# EasyEDA schematic Joakims fulle kort kretsskjema.json
TITLE: Watchdog module; REV: 2.5; Date: 2023-03-01; Sheet: 1/1; Drawn By: Joakim Vigemyr, Elab; Company: Department of Chemistry(UiO)
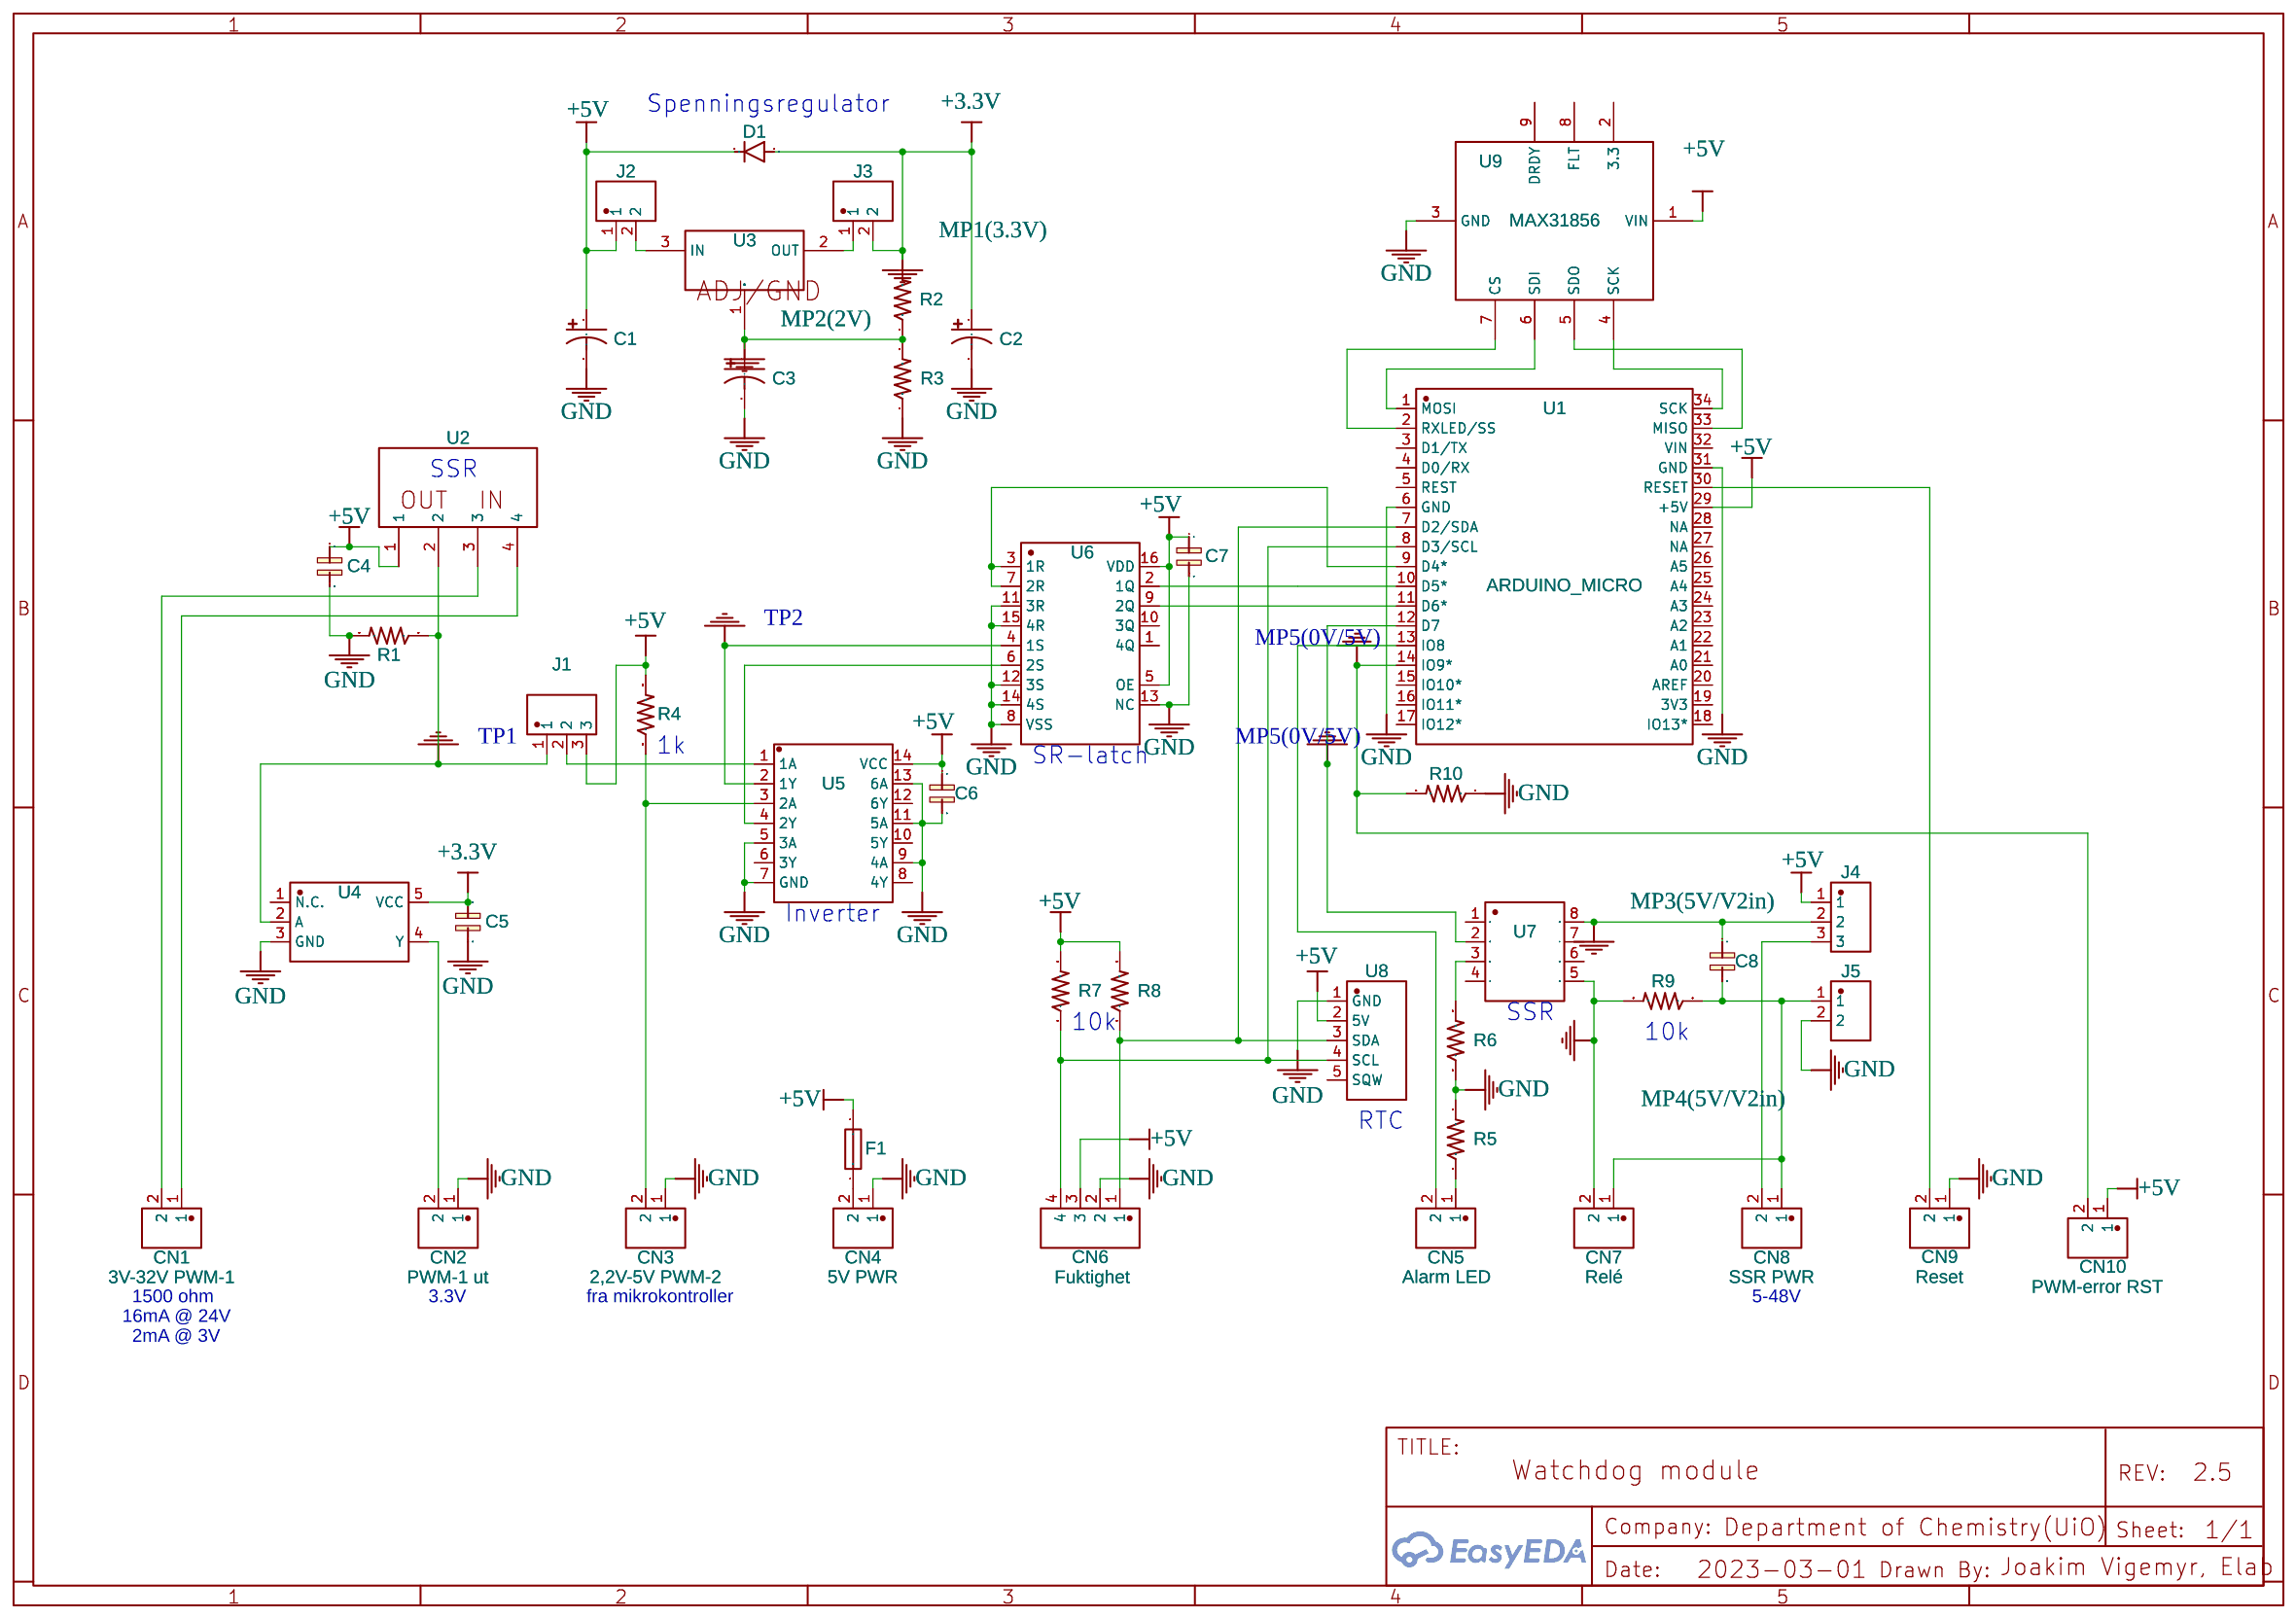
[diagram p0: schematic sheet]

## Parts
C1  10uF  [CPOL-RADIAL-100UF-25V]
C2  100uF  [CPOL-RADIAL-100UF-25V]
C3  47uF  [CPOL-RADIAL-100UF-25V]
C4  C_3216MP  [C3216MP]
C5  C_3216MP  [C3216MP]
C6  C_3216MP  [C3216MP]
C7  C_3216MP  [C3216MP]
C8  C_3216MP  [C3216MP]
CN1  3V-32V PWM-1  [CONN-TH_2P-P5.00_PHOENIX-CONTACT_1754436]
CN2  PWM-1 ut  [CONN-TH_2P-P5.00_PHOENIX-CONTACT_1754436]
CN3  2,2V-5V PWM-2  [CONN-TH_2P-P5.00_PHOENIX-CONTACT_1754436]
CN4  5V PWR  [CONN-TH_2P-P5.00_PHOENIX-CONTACT_1754436]
CN5  Alarm LED  [CONN-TH_2P-P5.00_PHOENIX-CONTACT_1754436]
CN6  Fuktighet  [CONN-TH_4P-P5.08_PHOENIXCONTACT_1888700]
CN7  Relé  [CONN-TH_2P-P5.00_PHOENIX-CONTACT_1754436]
CN8  SSR PWR  [CONN-TH_2P-P5.00_PHOENIX-CONTACT_1754436]
CN9  Reset  [CONN-TH_2P-P5.00_PHOENIX-CONTACT_1754436]
CN10  PWM-error RST  [CONN-TH_2P-P5.00_PHOENIX-CONTACT_1754436]
D1  1N4007  [DIODE-1N4001-KIT]
F1  0326025.MXP  [FUSE-SMD_LITTELFUSE-0326025]
J1  JUMPER3  [HDR-TH_3P-P2.54-V-M-A]
J2  JUMPER2  [HDR-TH_2P-P2.54-V-M-1]
J3  JUMPER2  [HDR-TH_2P-P2.54-V-M-1]
J4  JUMPER3  [HDR-TH_3P-P2.54-V-M-A]
J5  JUMPER2  [HDR-TH_2P-P2.54-V-M-1]
R1  200ohm  [AXIAL-0.1]
R2  200ohm  [AXIAL-0.1]
R3  330ohm  [AXIAL-0.1]
R4  1k  [AXIAL-0.1]
R5  180ohm  [AXIAL-0.1]
R6  330ohm  [AXIAL-0.1]
R7  10k  [AXIAL-0.1]
R8  10k  [AXIAL-0.1]
R9  10k  [AXIAL-0.1]
R10  10k  [AXIAL-0.1]
U1  ARDUINO_MICRO  [ARDUINO_MICRO]
U2  MPDCD3  [OPTO-TH_SENSATA_MPDCD3-B]
U3  TLV1117  [TO-252-3_L6.6-W6.1-P4.57-LS9.9-BR-CW]
U4  SN74LVC1G34  [SOT-23-5_L2.9-W1.6-P0.95-LS2.8-BL]
U5  SN74ACT04D  [SOIC-14_L8.7-W3.9-P1.27-LS6.0-BL]
U6  HEF4043BT,652  [SOIC-16_150MIL]
U7  XR2A-0811-N  [DIP-8_L10.2-W10.2-P2.54-LS7.6-BL]
U8  DS1307
U9  MAX31856  [ADAFRUIT MAX31856 BREAKOUT]

## Library data of the parts
C1-C3 = CAP_POLPTH1: Capacitor Polarized; Contributor: SparkFun
C4-C8 = -: Contributor: David Mora; Manufacturer Part: ?
CN1-CN5 CN7-CN10 = 1754436: Supplier: LCSC; Supplier Part: C3586499; Manufacturer: Phoenix Contact(菲尼克斯); link: https://atta.szlcsc.comnull; Contributor: lcsc
CN6 = 1888700: Supplier: LCSC; Supplier Part: C3816378; Manufacturer: Phoenix Contact(菲尼克斯); link: https://atta.szlcsc.comnull; Contributor: lcsc
D1 = DIODEKIT2: Diode; Contributor: SparkFun
F1 = 0326025.MXP: Supplier: LCSC; Supplier Part: C178977; Manufacturer: Littelfuse(美国力特); Contributor: lcsc; JLCPCB Part Class: Extended Part
J1 J4 = JUMPER3: Supplier: LCSC; Supplier Part: C2940050; Manufacturer: null; Manufacturer Part: Jumper3; Contributor: LCSC; JLCPCB Part Class: Extended Part
J2 J3 J5 = JUMPER2: Supplier: LCSC; Supplier Part: C2940092; Manufacturer: null; Manufacturer Part: Jumper2; Contributor: LCSC; JLCPCB Part Class: Extended Part
R1-R10 = RESISTORPTH-14W-VERT: Resistor; Contributor: SparkFun
U1 = ARDUINO_MICRO: Contributor: EasyEDA
U2 = MPDCD3-B: Supplier: LCSC; Supplier Part: C2616825; Manufacturer: Sensata; Contributor: LCSC
U3 = TLV1117-18CKVURG3: Supplier: LCSC; Supplier Part: C2870812; Manufacturer: TI(德州仪器); link: https://atta.szlcsc.comnull; Contributor: lcsc
U4 = SN74LVC1G17DBVT: Supplier: LCSC; Supplier Part: C2862344; Manufacturer: TI(德州仪器); link: https://atta.szlcsc.comnull; JLCPCB Part Class: Extended Part; Contributor: LCSC
U5 = SN74AC04DR: Supplier: LCSC; Supplier Part: C352940; Manufacturer: Texas Instruments; Contributor: LCSC; LCSC Assembly: Yes; SMT Type: Extend
U6 = -: Supplier: LCSC; Manufacturer: Nexperia; Manufacturer Part: HEF4543BT,653; Contributor: Jorgen_Hilsen; Supplier Part: C131489
U7 = XR2A-0811-N: Supplier: LCSC; Supplier Part: C231487; Manufacturer: OMRON(欧姆龙); Contributor: LCSC; JLCPCB Part Class: Extended Part
U8 = DS1307
U9 = -: link: https://learn.adafruit.com/adafruit-max31856-thermocouple-amplifier; Contributor: jove1

## Nets
+3.3V: C2.1(+) C5.1 D1.A J3.2 R2.P$2(2) U4.5(VCC)
+5V: C1.1(+) C4.1 C6.1 C7.1 CN6.3 CN10.1 D1.C F1.2 J1.3 J2.1 J4.1 R4.P$2(2) R7.P$2(2) R8.P$2(2) U1.29(+5V) U2.1 U5.14(VCC) U6.5(OE) U6.16(VDD) U8.2(5V) U9.1(VIN)
GND: C1.2(-) C2.2(-) C3.2(-) C4.2 C5.2 C6.2 C7.2 CN2.1 CN3.1 CN4.1 CN6.2 CN9.1 J5.2 R1.P$2(2) R3.P$1(1) R5.P$2(2) R6.P$1(1) R10.P$1(1) U1.6(GND) U1.31(GND) U4.3(GND) U5.5(3A) U5.7(GND) U5.9(4A) U5.11(5A) U5.13(6A) U6.8(VSS) U6.11(3R) U6.12(3S) U6.13(NC) U6.14(4S) U6.15(4R) U8.1(GND) U9.3(GND)
MP3(5V/V2in): C8.1 J4.2 U7.8
MP4(5V/V2in): CN7.2 R9.P$2(2) U7.5
MP5(0V/5V): CN10.2 R10.P$2(2) U1.12(D7) U1.14(IO9*) U7.2
MP2(2V): C3.1(+) R2.P$1(1) R3.P$2(2) U3.1(ADJ/GND)
TP1: J1.1 R1.P$1(1) U2.2 U4.2(A)
TP2: U5.2(1Y) U6.4(1S)
Net-(C8-2): C8.2 CN7.1 CN8.1 J5.1 R9.P$1(1)
Net-(CN1-1): CN1.1 U2.4
Net-(CN1-2): CN1.2 U2.3
Net-(CN2-2): CN2.2 U4.4(Y)
Net-(CN3-2): CN3.2 R4.P$1(1) U5.3(2A)
Net-(CN4-2): CN4.2 F1.1
Net-(CN5-1): CN5.1 R5.P$1(1)
Net-(CN5-2): CN5.2 U1.13(IO8)
Net-(CN6-1): CN6.1 R8.P$1(1) U1.7(D2/SDA) U8.3(SDA)
Net-(CN6-4): CN6.4 R7.P$1(1) U1.8(D3/SCL) U8.4(SCL)
Net-(CN8-2): CN8.2 J4.3
Net-(CN9-2): CN9.2 U1.30(RESET)
Net-(J1-2): J1.2 U5.1(1A)
Net-(J2-2): J2.2 U3.3(IN)
Net-(J3-1): J3.1 U3.2(OUT)
Net-(R6-P$2): R6.P$2(2) U7.3
Net-(U1-1): U1.1(MOSI) U9.6(SDI)
Net-(U1-2): U1.2(RXLED/SS) U9.7(CS)
Net-(U1-9): U1.9(D4*) U6.3(1R) U6.7(2R)
Net-(U1-10): U1.10(D5*) U6.2(1Q)
Net-(U1-11): U1.11(D6*) U6.9(2Q)
Net-(U1-33): U1.33(MISO) U9.5(SDO)
Net-(U1-34): U1.34(SCK) U9.4(SCK)
Net-(U5-4): U5.4(2Y) U6.6(2S)

Not connected (* = marked no-connect by the designer): U1 3(D1/TX) 4(D0/RX) 5(REST) 15(IO10*) 16(IO11*) 17(IO12*) 18(IO13*) 19(3V3) 20(AREF) 21(A0) 22(A1) 23(A2) 24(A3) 25(A4) 26(A5) 27(NA) 28(NA) 32(VIN); U4 1(N.C.); U5 6(3Y) 8(4Y) 10(5Y) 12(6Y); U6 1(4Q) 10(3Q); U7 1 4 6 7; U8 5(SQW); U9 2(3.3) 8(FLT) 9(DRDY)

## Notes on the sheet
- Spenningsregulator
- SSR
- 1k
- SR-latch
- Inverter
- SSR
- 10k
- 10k
- RTC
- 1500 ohm
- 3.3V
- fra mikrokontroller
- 5-48V
- 16mA @ 24V
- 2mA @ 3V
